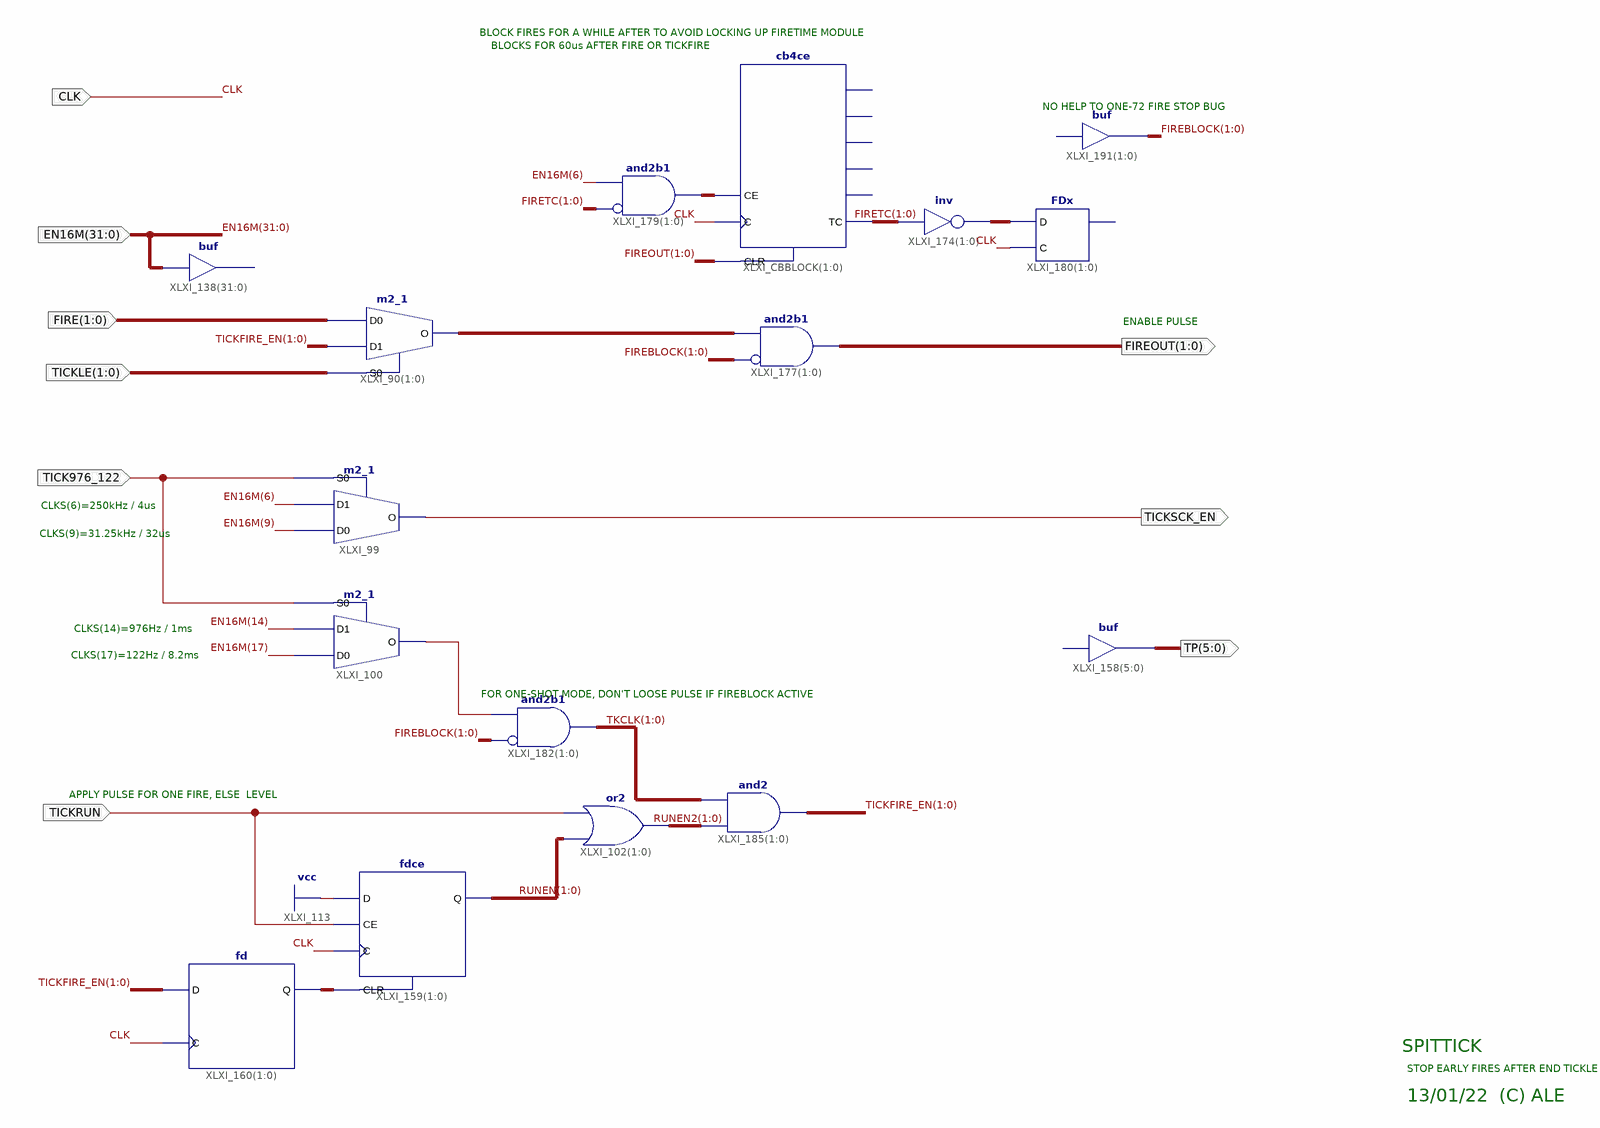
[diagram p0: schematic sheet 1]
// Xilinx ISE schematic SpitTick.sch (spartan3e) as structural Verilog: 16 symbols, 9 ports
module SpitTick (
  input  CLK,
  input  [31:0] EN16M,
  input  [1:0] FIRE,
  input  [1:0] TICKLE,
  input  TICK976_122,
  input  TICKRUN,
  output [1:0] FIREOUT,
  output TICKSCK_EN,
  output [5:0] TP
);

  wire XLXN_261;
  wire [1:0] FIREBLOCK, FIRETC, RUNEN, RUNEN2, TICKFIRE_EN, TKCLK, XLXN_252, XLXN_254, XLXN_269, XLXN_280;

  m2_1 XLXI_99 (.D0(EN16M[9]), .D1(EN16M[6]), .S0(TICK976_122), .O(TICKSCK_EN));
  assign RUNEN2 = {2{TICKRUN}} | RUNEN;  // or2 XLXI_102[1..0], 2 bits wide
  // buf XLXI_138[31..0] has open pins: I=EN16M, O=open
  // buf XLXI_158[5..0] has open pins: I=open, O=TP
  fdce XLXI_159[1:0] (.C(CLK), .CE(TICKRUN), .CLR(XLXN_269), .D(1'b1), .Q(RUNEN));
  fd XLXI_160[1:0] (.C(CLK), .D(TICKFIRE_EN), .Q(XLXN_269));
  cb4ce XLXI_CBBLOCK[1:0] (.C(CLK), .CE(XLXN_252), .CLR(FIREOUT), .TC(FIRETC));  // open: CEO, Q0, Q1, Q2, Q3
  assign XLXN_280 = ~FIRETC;  // inv XLXI_174[1..0], 2 bits wide
  m2_1 XLXI_90[1:0] (.D0(FIRE), .D1(TICKFIRE_EN), .S0(TICKLE), .O(XLXN_254));
  assign FIREOUT = ~FIREBLOCK & XLXN_254;  // and2b1 XLXI_177[1..0], 2 bits wide
  assign XLXN_252 = ~FIRETC & {2{EN16M[6]}};  // and2b1 XLXI_179[1..0], 2 bits wide
  m2_1 XLXI_100 (.D0(EN16M[17]), .D1(EN16M[14]), .S0(TICK976_122), .O(XLXN_261));
  assign TKCLK = ~FIREBLOCK & {2{XLXN_261}};  // and2b1 XLXI_182[1..0], 2 bits wide
  assign TICKFIRE_EN = RUNEN2 & TKCLK;  // and2 XLXI_185[1..0], 2 bits wide
  FDx XLXI_180[1:0] (.C(CLK), .D(XLXN_280));  // open: Q
  // buf XLXI_191[1..0] has open pins: I=open, O=FIREBLOCK

  // Notes on the sheet:
  //   BLOCK FIRES FOR A WHILE AFTER TO AVOID LOCKING UP FIRETIME MODULE
  //   BLOCKS FOR 60us AFTER FIRE OR TICKFIRE
  //   NO HELP TO ONE-72 FIRE STOP BUG
  //   ENABLE PULSE
  //   CLKS(6)=250kHz / 4us
  //   CLKS(9)=31.25kHz / 32us
  //   CLKS(14)=976Hz / 1ms
  //   CLKS(17)=122Hz / 8.2ms
  //   FOR ONE-SHOT MODE, DON'T LOOSE PULSE IF FIREBLOCK ACTIVE
  //   APPLY PULSE FOR ONE FIRE, ELSE  LEVEL
  //   SPITTICK
  //   STOP EARLY FIRES AFTER END TICKLE
  //   13/01/22  (C) ALE
endmodule
